# EAGLE design breakout (EAGLE 6.1)
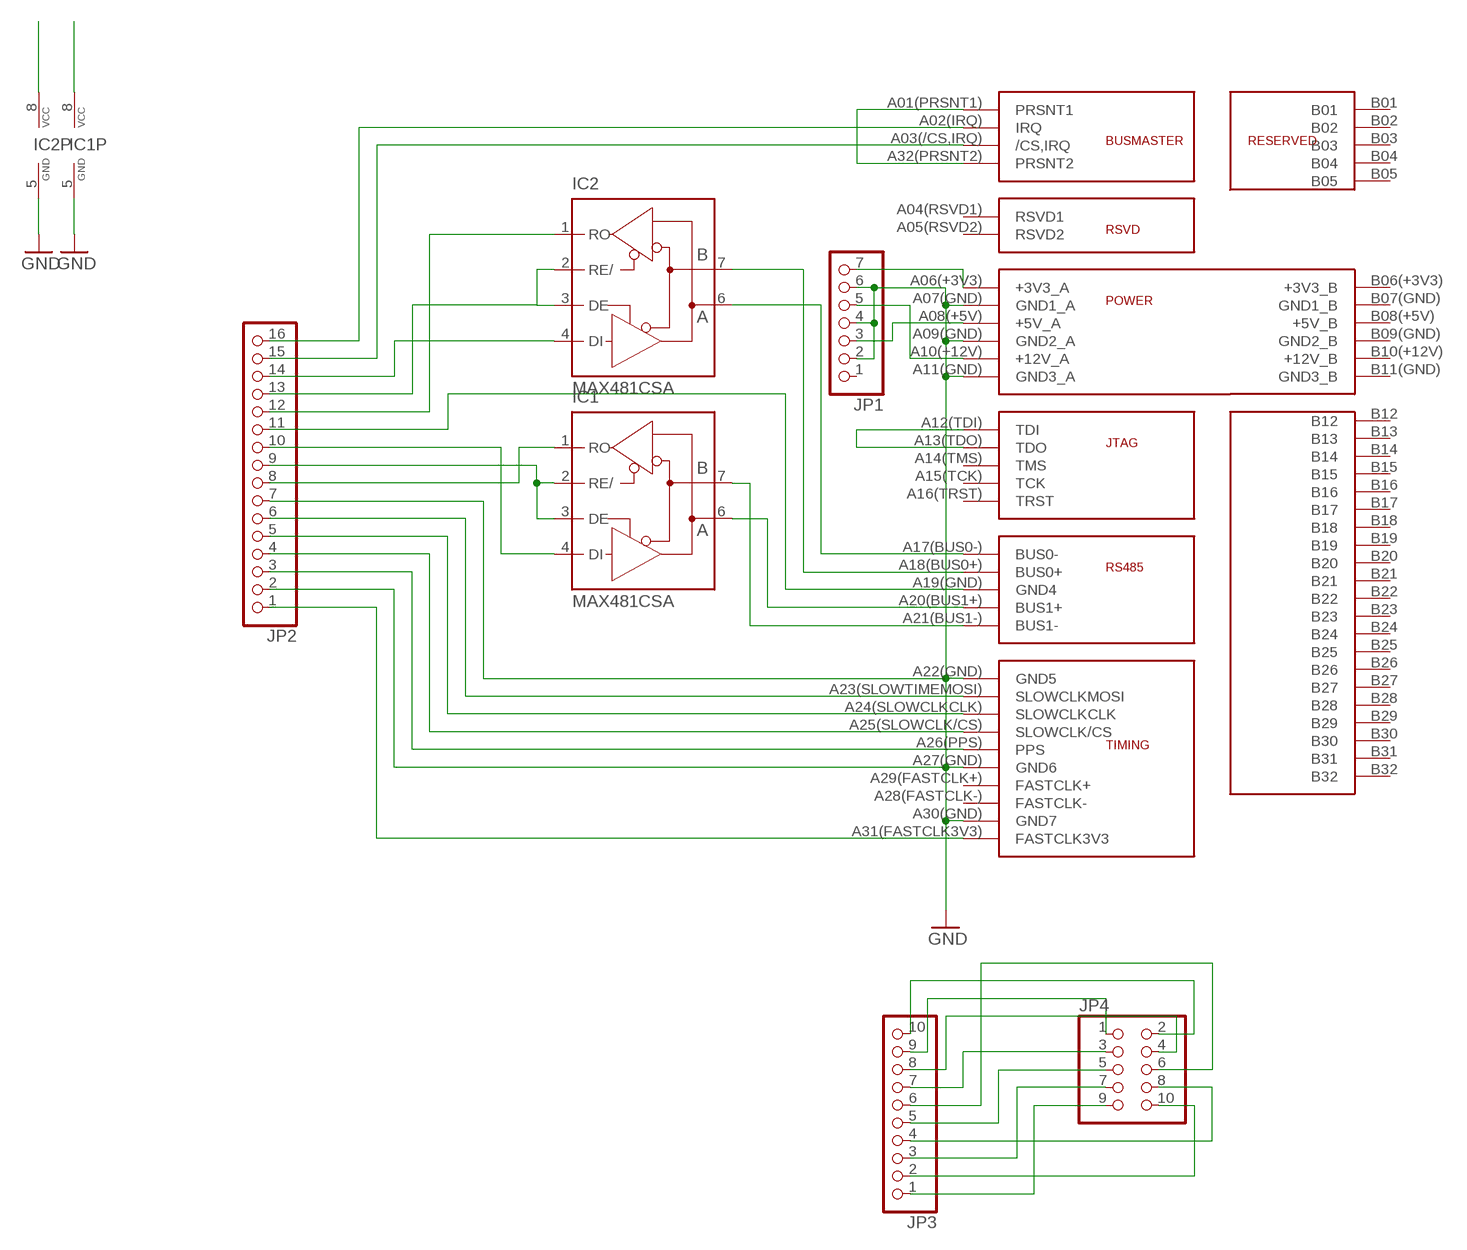
[diagram p0: schematic, sheet 1]

## Parts
IC1  MAX481CSA  [SO08]
IC2  MAX481CSA  [SO08]
JP1  PINHD-1X7  [1X07]
JP2  PINHD-1X16  [1X16]
JP3  PINHD-1X10  [1X10]
JP4  PINHD-2X5  [2X05]
U$1  FRIENDSHIPCONNECTOR  [FRIENDSHIP_EDGE_CONNECTOR]

## Nets
GND: IC1.5(GND) IC2.5(GND) JP1.2 JP1.4 JP1.6 JP2.2 JP2.7 U$1.A07(GND)(GND1_A) U$1.A09(GND)(GND2_A) U$1.A11(GND)(GND3_A) U$1.A22(GND)(GND5) U$1.A27(GND)(GND6) U$1.A30(GND)(GND7)
N$1: U$1.A01(PRSNT1)(PRSNT1) U$1.A32(PRSNT2)(PRSNT2)
N$2: IC2.6(A) U$1.A17(BUS0-)(BUS0-)
N$3: IC2.7(B) U$1.A18(BUS0+)(BUS0+)
N$4: IC2.2(RE/) IC2.3(DE) JP2.13
N$5: JP2.16 U$1.A02(IRQ)(IRQ)
N$6: JP2.15 U$1.A03(/CS,IRQ)(/CS,IRQ)
N$7: IC1.6(A) U$1.A20(BUS1+)(BUS1+)
N$8: IC2.4(DI) JP2.14
N$9: IC1.7(B) U$1.A21(BUS1-)(BUS1-)
N$10: JP2.11 U$1.A19(GND)(GND4)
N$11: IC1.2(RE/) IC1.3(DE) JP2.9
N$12: U$1.A12(TDI)(TDI) U$1.A13(TDO)(TDO)
N$13: JP1.5 U$1.A10(+12V)(+12V_A)
N$14: IC2.1(RO) JP2.12
N$15: IC1.1(RO) JP2.8
N$16: IC1.4(DI) JP2.10
N$17: JP2.6 U$1.A23(SLOWTIMEMOSI)(SLOWCLKMOSI)
N$18: JP1.3 U$1.A08(+5V)(+5V_A)
N$19: JP2.5 U$1.A24(SLOWCLKCLK)(SLOWCLKCLK)
N$20: JP2.4 U$1.A25(SLOWCLK/CS)(SLOWCLK/CS)
N$21: JP2.3 U$1.A26(PPS)(PPS)
N$22: JP3.10 JP4.2
N$23: JP2.1 U$1.A31(FASTCLK3V3)(FASTCLK3V3)
N$24: JP3.9 JP4.1
N$25: JP3.8 JP4.4
N$26: JP3.7 JP4.3
N$27: JP3.6 JP4.6
N$28: JP3.5 JP4.5
N$29: JP3.3 JP4.7
N$30: JP3.4 JP4.8
N$31: JP3.2 JP4.10
N$32: JP3.1 JP4.9
VCC: IC1.8(VCC) IC2.8(VCC) JP1.7 U$1.A06(+3V3)(+3V3_A)
Unconnected: JP1.1 U$1.A04(RSVD1)(RSVD1) U$1.A05(RSVD2)(RSVD2) U$1.A14(TMS)(TMS) U$1.A15(TCK)(TCK) U$1.A16(TRST)(TRST) U$1.A28(FASTCLK-)(FASTCLK-) U$1.A29(FASTCLK+)(FASTCLK+) U$1.B01 U$1.B02 U$1.B03 U$1.B04 U$1.B05 U$1.B06(+3V3)(+3V3_B) U$1.B07(GND)(GND1_B) U$1.B08(+5V)(+5V_B) U$1.B09(GND)(GND2_B) U$1.B10(+12V)(+12V_B) U$1.B11(GND)(GND3_B) U$1.B12 U$1.B13 U$1.B14 U$1.B15 U$1.B16 U$1.B17 U$1.B18 U$1.B19 U$1.B20 U$1.B21 U$1.B22 U$1.B23 U$1.B24 U$1.B25 U$1.B26 U$1.B27 U$1.B28 U$1.B29 U$1.B30 U$1.B31 U$1.B32

## Library data of the parts
IC1 IC2 = maxim:MAX481CSA: RS485 TRANSEIVER; MF: MAXIM; MPN: MAX481CSA; OC_FARNELL: unknown; OC_NEWARK: 90C3817
JP1 = pinhead:PINHD-1X7: PIN HEADER
JP2 = pinhead:PINHD-1X16: PIN HEADER
JP3 = pinhead:PINHD-1X10: PIN HEADER
JP4 = pinhead:PINHD-2X5: PIN HEADER
U$1 = hgg:FRIENDSHIP

## Board
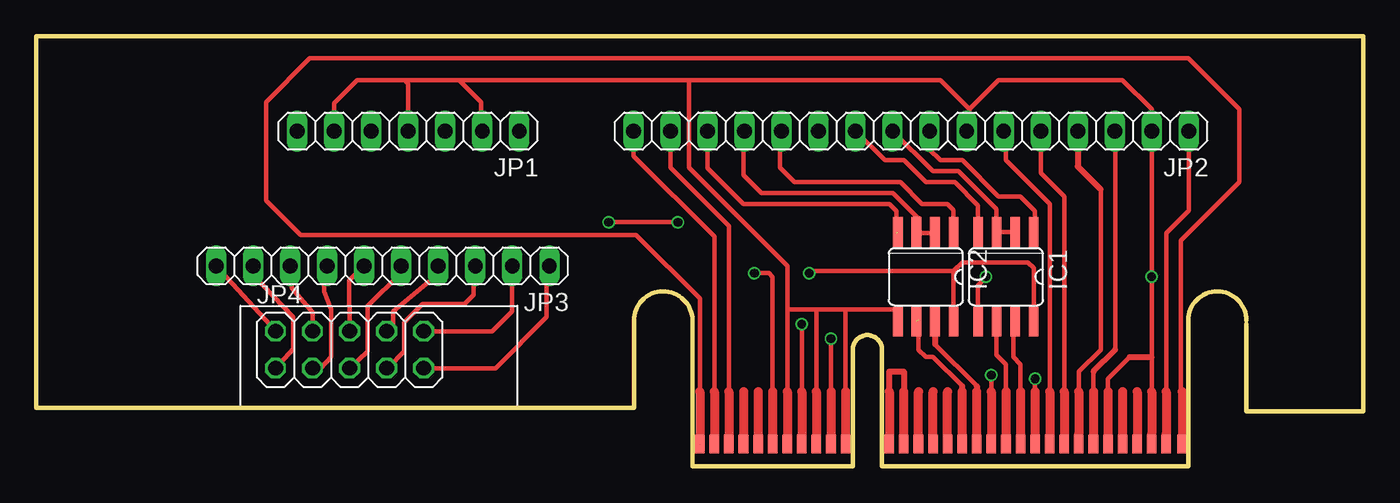
[diagram p1: board, top side]
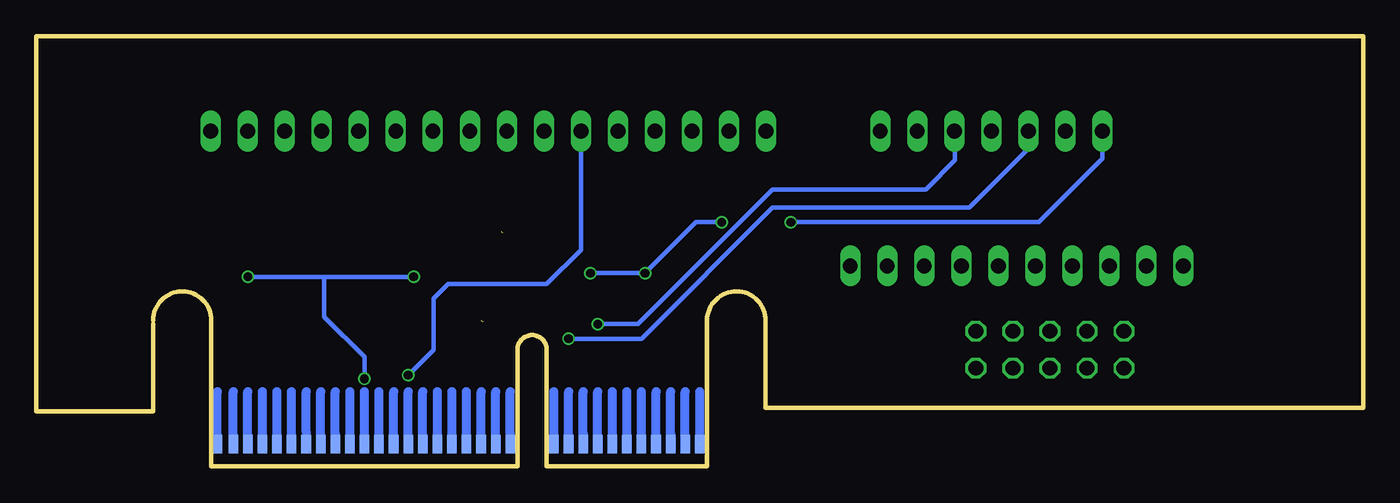
[diagram p2: board, bottom side, seen from below]

Size 91 x 29.5 mm. Coordinates in mm from the lower left corner, seen from the top.
Outline: 41,9.75 41,4 0,4 0,29.5 91,29.5 91,3.75 83,3.75 83,9.75
Outline: 41,9.75 41,10.25
Outline: 41,9.75 arc-187 45,10 45,0 56,0 56,8 arc-180 58,8 58,0 79,0 79,10 arc-180 83,10
Copper layers (1*16): Top 0.035mm / dielectric 1.5mm / Bottom 0.035mm
Design rules: minimum track width 0.125mm, minimum drill 0.2mm, track to track 0.125mm, track to pad 0.125mm, pad to pad 0.125mm, via to via 0.125mm, smd to smd 0.125mm, copper to edge 0.3mm, drill to drill 0.2mm, minimum pad ring 0.2mm, minimum via ring 0.125mm, stop-mask expansion 0.075mm, vias tented up to drill 0mil, thermal gap 0.2mm

### Footprints (pad centres in the part's own frame; a part is rotated, then mirrored left to right if it is on the bottom)
SO08 = smd 0.66 x 2.032: 1 -1.905,-3.073; 2 -0.635,-3.073; 3 0.635,-3.073; 4 1.905,-3.073; 5 1.905,3.073; 6 0.635,3.073; 7 -0.635,3.073; 8 -1.905,3.073
1X07 = drill 1.016 long: 1 -7.62,0; 2 -5.08,0; 3 -2.54,0; 4 0,0; 5 2.54,0; 6 5.08,0; 7 7.62,0
1X16 = drill 1.016 long: 1 -19.05,0; 2 -16.51,0; 3 -13.97,0; 4 -11.43,0; 5 -8.89,0; 6 -6.35,0; 7 -3.81,0; 8 -1.27,0; 9 1.27,0; 10 3.81,0; 11 6.35,0; 12 8.89,0; 13 11.43,0; 14 13.97,0; 15 16.51,0; 16 19.05,0
1X10 = drill 1.016 long: 1 -11.43,0; 2 -8.89,0; 3 -6.35,0; 4 -3.81,0; 5 -1.27,0; 6 1.27,0; 7 3.81,0; 8 6.35,0; 9 8.89,0; 10 11.43,0
2X05 = drill 1.016 octagon: 1 -5.08,-1.27; 2 -5.08,1.27; 3 -2.54,-1.27; 4 -2.54,1.27; 5 0,-1.27; 6 0,1.27; 7 2.54,-1.27; 8 2.54,1.27; 9 5.08,-1.27; 10 5.08,1.27
FRIENDSHIP_EDGE_CONNECTOR = smd 0.66 x 1.27: A01(PRSNT1) 45.5,-14.5; A02(IRQ) 46.5,-14.5; A03(/CS,IRQ) 47.5,-14.5; A04(RSVD1) 48.5,-14.5; A05(RSVD2) 49.5,-14.5; A06(+3V3) 50.5,-14.5; A07(GND) 51.5,-14.5; A08(+5V) 52.5,-14.5; A09(GND) 53.5,-14.5; A10(+12V) 54.5,-14.5; A11(GND) 55.5,-14.5; A12(TDI) 58.5,-14.5; A13(TDO) 59.5,-14.5; A14(TMS) 60.5,-14.5; A15(TCK) 61.5,-14.5; A16(TRST) 62.5,-14.5; A17(BUS0-) 63.5,-14.5; A18(BUS0+) 64.5,-14.5; A19(GND) 65.5,-14.5; A20(BUS1+) 66.5,-14.5; A21(BUS1-) 67.5,-14.5; A22(GND) 68.5,-14.5; A23(SLOWTIMEMOSI) 69.5,-14.5; A24(SLOWCLKCLK) 70.5,-14.5; A25(SLOWCLK/CS) 71.5,-14.5; A26(PPS) 72.5,-14.5; A27(GND) 73.5,-14.5; A28(FASTCLK-) 74.5,-14.5; A29(FASTCLK+) 75.5,-14.5; A30(GND) 76.5,-14.5; A31(FASTCLK3V3) 77.5,-14.5; A32(PRSNT2) 78.6,-14.5 | smd 0.66 x 1.27 bottom: B01 45.5,-14.5; B02 46.5,-14.5; B03 47.5,-14.5; B04 48.5,-14.5; B05 49.5,-14.5; B06(+3V3) 50.5,-14.5; B07(GND) 51.5,-14.5; B08(+5V) 52.5,-14.5; B09(GND) 53.5,-14.5; B10(+12V) 54.5,-14.5; B11(GND) 55.5,-14.5; B12 58.5,-14.5; B13 59.5,-14.5; B14 60.5,-14.5; B15 61.5,-14.5; B16 62.5,-14.5; B17 63.5,-14.5; B18 64.5,-14.5; B19 65.5,-14.5; B20 66.5,-14.5; B21 67.5,-14.5; B22 68.5,-14.5; B23 69.5,-14.5; B24 70.5,-14.5; B25 71.5,-14.5; B26 72.5,-14.5; B27 73.5,-14.5; B28 74.5,-14.5; B29 75.5,-14.5; B30 76.5,-14.5; B31 77.5,-14.5; B32 78.6,-14.5

### Placement (x,y rotation side)
IC1  66.5,13 180 top
IC2  61,13 180 top
JP1  25.5,23 180 top
JP2  60,23 180 top
JP3  23.75,13.75 180 top
JP4  21.48,8 0 top
U$1  0,16.01 0 top

### Tracks (layer width: path | path; a pad name or v marks a point on that pad's centre or on a via)
GND  (via drill 0.6)
  Top 0.305: 25.25,26.5 22,26.5 20.42,24.92 JP1.6 | 29,26.5 44.75,26.5 | 44.75,26.5 62,26.5 64,24.5 | 64,23.19 64,24.5 | 64,24.5 66,26.5 74.5,26.5 76.5,24.5 JP2.2 | JP2.2 v76.5,13 76.5,7.5 U$1.A30(GND) | U$1.A27(GND) 73.5,6 75,7.5 | U$1.A22(GND) v68.5,6 | IC1.5 64.59,12.4 v65.12,13 | U$1.A07(GND) 51.5,10.75 | U$1.A11(GND) 55.5,10.75 | 55.5,10.75 53.5,10.75 | 53.5,10.75 51.5,10.75 | U$1.A09(GND) 53.5,10.75 | JP1.4 25.5,26.25 25.25,26.5 | 25.25,26.5 29,26.5 | 29,26.5 30.5,25 30.5,23.58 JP1.2 | 44.75,26.5 44.75,20.5 51.5,13.75 51.5,10.75 | IC2.5 59.09,10.6 59.25,10.75 55.5,10.75
  Top 0.406: 64,23.19 JP2.7 | JP2.2 | 75,7.5 76.5,7.5
  Bottom 0.305: v65.12,13 71.25,13 | 71.25,13 v76.5,13 | v68.5,6 68.5,7.5 71.25,10.25 71.25,13
N$1  (1 unrouted)
  Top 0.305: 78.5,1.51 78.5,15.5 82.5,19.5 82.5,24.5 79,28 18.75,28 15.75,25 15.75,18.25 18.12,15.88 41.12,15.88 45.5,11.5 U$1.A01(PRSNT1)
  Top 0.406: U$1.A32(PRSNT2) 78.5,1.51
N$2  (1 unrouted)
  Top 0.305: 63.5,5.5 61.5,7.5 61,7.5 60.5,8 60.5,10
  Top 0.406: U$1.A17(BUS0-) 63.5,5.5
N$3
  Top 0.305: 61.63,8.37 64.5,5.5
  Top 0.406: IC2.7 61.63,8.37 | 64.5,5.5 U$1.A18(BUS0+)
N$4
  Top 0.305: 60.5,17 58.75,18.75 49.75,18.75 48.5,20 48.5,22.93 JP2.13 | 60.5,16 61.56,16 IC2.2
  Top 0.406: 60.5,17 60.5,16 60.44,16 IC2.3
N$5
  Top 0.305: JP2.16 40.95,21.3 46.5,15.75 U$1.A02(IRQ)
N$6
  Top 0.305: U$1.A03(/CS,IRQ) 47.5,16.5 43.5,20.5 JP2.15
N$7
  Top 0.305: IC1.6 65.86,7.63 66.5,7 U$1.A20(BUS1+)
N$8  (1 unrouted)
  Top 0.305: JP2.14 46.03,20.47 48.5,18 58.5,18 59,17.5 59,16
N$9
  Top 0.305: U$1.A21(BUS1-) 67.5,7 67,7.5 67,9.79
  Top 0.406: 67,9.79 IC1.7
N$10  (via drill 0.6)
  Top 0.305: v65.5,6.25 U$1.A19(GND)
  Bottom 0.305: JP2.11 53.65,14.85 56,12.5 62.75,12.5 63.75,11.5 63.75,8 v65.5,6.25
N$11
  Top 0.305: IC1.2 IC1.3 65.86,17.64 63.25,20.25 61.48,20.25 JP2.9
N$12
  Top 0.406: U$1.A12(TDI) 58.5,6.5 59.5,6.5 U$1.A13(TDO)
N$13  (via drill 0.6)
  Top 0.305: v54.5,8.75 U$1.A10(+12V)
  Bottom 0.305: JP1.5 22.96,21.79 27,17.75 40.5,17.75 49.5,8.75 v54.5,8.75
N$14
  Top 0.305: IC2.1 62.91,17.59 62.5,18 60.75,18 59.25,19.5 52,19.5 51,20.5 51,22.89
  Top 0.406: 51,22.89 JP2.12
N$15
  Top 0.305: JP2.8 61.27,21.73 62,21 63.5,21 66,18.5 67.5,18.5 68.5,17.5 68.5,16.17
  Top 0.406: 68.5,16.17 IC1.1
N$16
  Top 0.305: IC1.4 64.59,17.91 63,19.5 61,19.5 59.5,21 58.19,21 JP2.10
N$17
  Top 0.305: U$1.A23(SLOWTIMEMOSI) 69.5,18 66.5,21 66.5,22.85
  Top 0.406: 66.5,22.85 JP2.6
N$18  (via drill 0.6)
  Top 0.305: U$1.A08(+5V) v52.5,9.75
  Bottom 0.305: v52.5,9.75 49.75,9.75 40.5,19 30,19 28,21 28,22.71 JP1.3
N$19
  Top 0.305: JP2.5 68.89,20.11 70.5,18.5 U$1.A24(SLOWCLKCLK)
N$20
  Top 0.305: 73,19 73,8 71.5,6.5 U$1.A25(SLOWCLK/CS)
  Top 0.406: JP2.4 71.43,20.57 73,19
N$21
  Top 0.305: U$1.A26(PPS) 72.5,6.5 | 74,8 74,23 JP2.3
  Top 0.406: 72.5,6.5 74,8
N$22
  Top 0.305: JP4.2 16.43,9.27 JP3.10
N$23
  Top 0.305: JP2.1 79.05,17.55 77.5,16 U$1.A31(FASTCLK3V3)
N$24
  Top 0.305: JP3.9 14.86,13.14 17.61,10.25 17.61,8.06 JP4.1
N$25
  Top 0.305: JP4.4 18.94,10.54 17.5,12.25 17.5,13.65 JP3.8
N$26
  Top 0.305: JP4.3 19.48,6.73 20.23,7.5 20.23,10.75 19.75,12 19.75,13.56 JP3.7
N$27
  Top 0.305: JP3.6 21.46,12.75 JP4.6
N$28
  Top 0.305: JP4.5 21.5,6.75 22.73,7.88 22.73,11 25,13.25 25,13.73 JP3.5
N$29
  Top 0.305: JP4.7 24.16,6.79 25.23,7.88 25.23,9.88 26.48,11.12 29.38,11.12 30,11.75 30,13.65 JP3.3
N$30
  Top 0.305: JP3.4 27.56,13.19 24.48,10.62 24.48,9.73 JP4.8
N$31
  Top 0.305: JP3.2 32.64,10.64 31.25,9.25 27.1,9.25 JP4.10
N$32
  Top 0.305: JP4.9 31.48,6.73 35,10.25 35,13.5 35.25,13.5 35.25,13.68 JP3.1
VCC  (via drill 0.6)
  Top 0.305: IC2.8 62.91,13.4 | 62.91,13.4 63.5,14 68,14 68.41,13.6 IC1.8 | U$1.A06(+3V3) 50.5,13 50.25,13.25 v49.25,13.25 | v39.25,16.75 v44,16.75 | 62.91,13.4 53.16,13.4 v53,13.25
  Bottom 0.305: JP1.7 17.88,21.12 22.25,16.75 v39.25,16.75 | v44,16.75 45.75,16.75 v49.25,13.25 v53,13.25